# Altium schematic sheet TIDA01398_MCU.SchDoc: Wireless MCU
size 431 x 279 mm; Date: Not shown in title block; ApprovedBy: Not shown in title block; CheckedBy: Not shown in title block; Author: Not shown in title block; CompanyName: Not shown in title block; DrawnBy: Gustavo Martinez; Engineer: Not shown in title block; Organization: Not shown in title block; Address1: Not shown in title block; Address2: Not shown in title block; Address3: Not shown in title block; Address4: Not shown in title block; DocumentNumber: 1; Revision: Use project parameter SCH_Rev; SheetNumber: 3; SheetTotal: 4; PageSetup: Record=PageOptions|CenterHorizontal=True|CenterVertical=True|PrintScale=1.00|XCorrection=1.00|YCorrection=1.00|PrintKind=0|BorderSize=5000000|LeftOffset=0|BottomOffset=0|Orientation=2|PaperLength=1000|PaperWidth=1000|Scale=100|PaperSource=15|PrintQuality=600|MediaType=1|DitherType=10|PaperKind=Letter|PrintScaleMode=1; CurrentTime: Not shown in title block; CurrentDate: Not shown in title block; Time: Not shown in title block; DocumentFullPathAndName: Not shown in title block; DocumentName: Not shown in title block; ModifiedDate: Not shown in title block; ImagePath: Not shown in title block
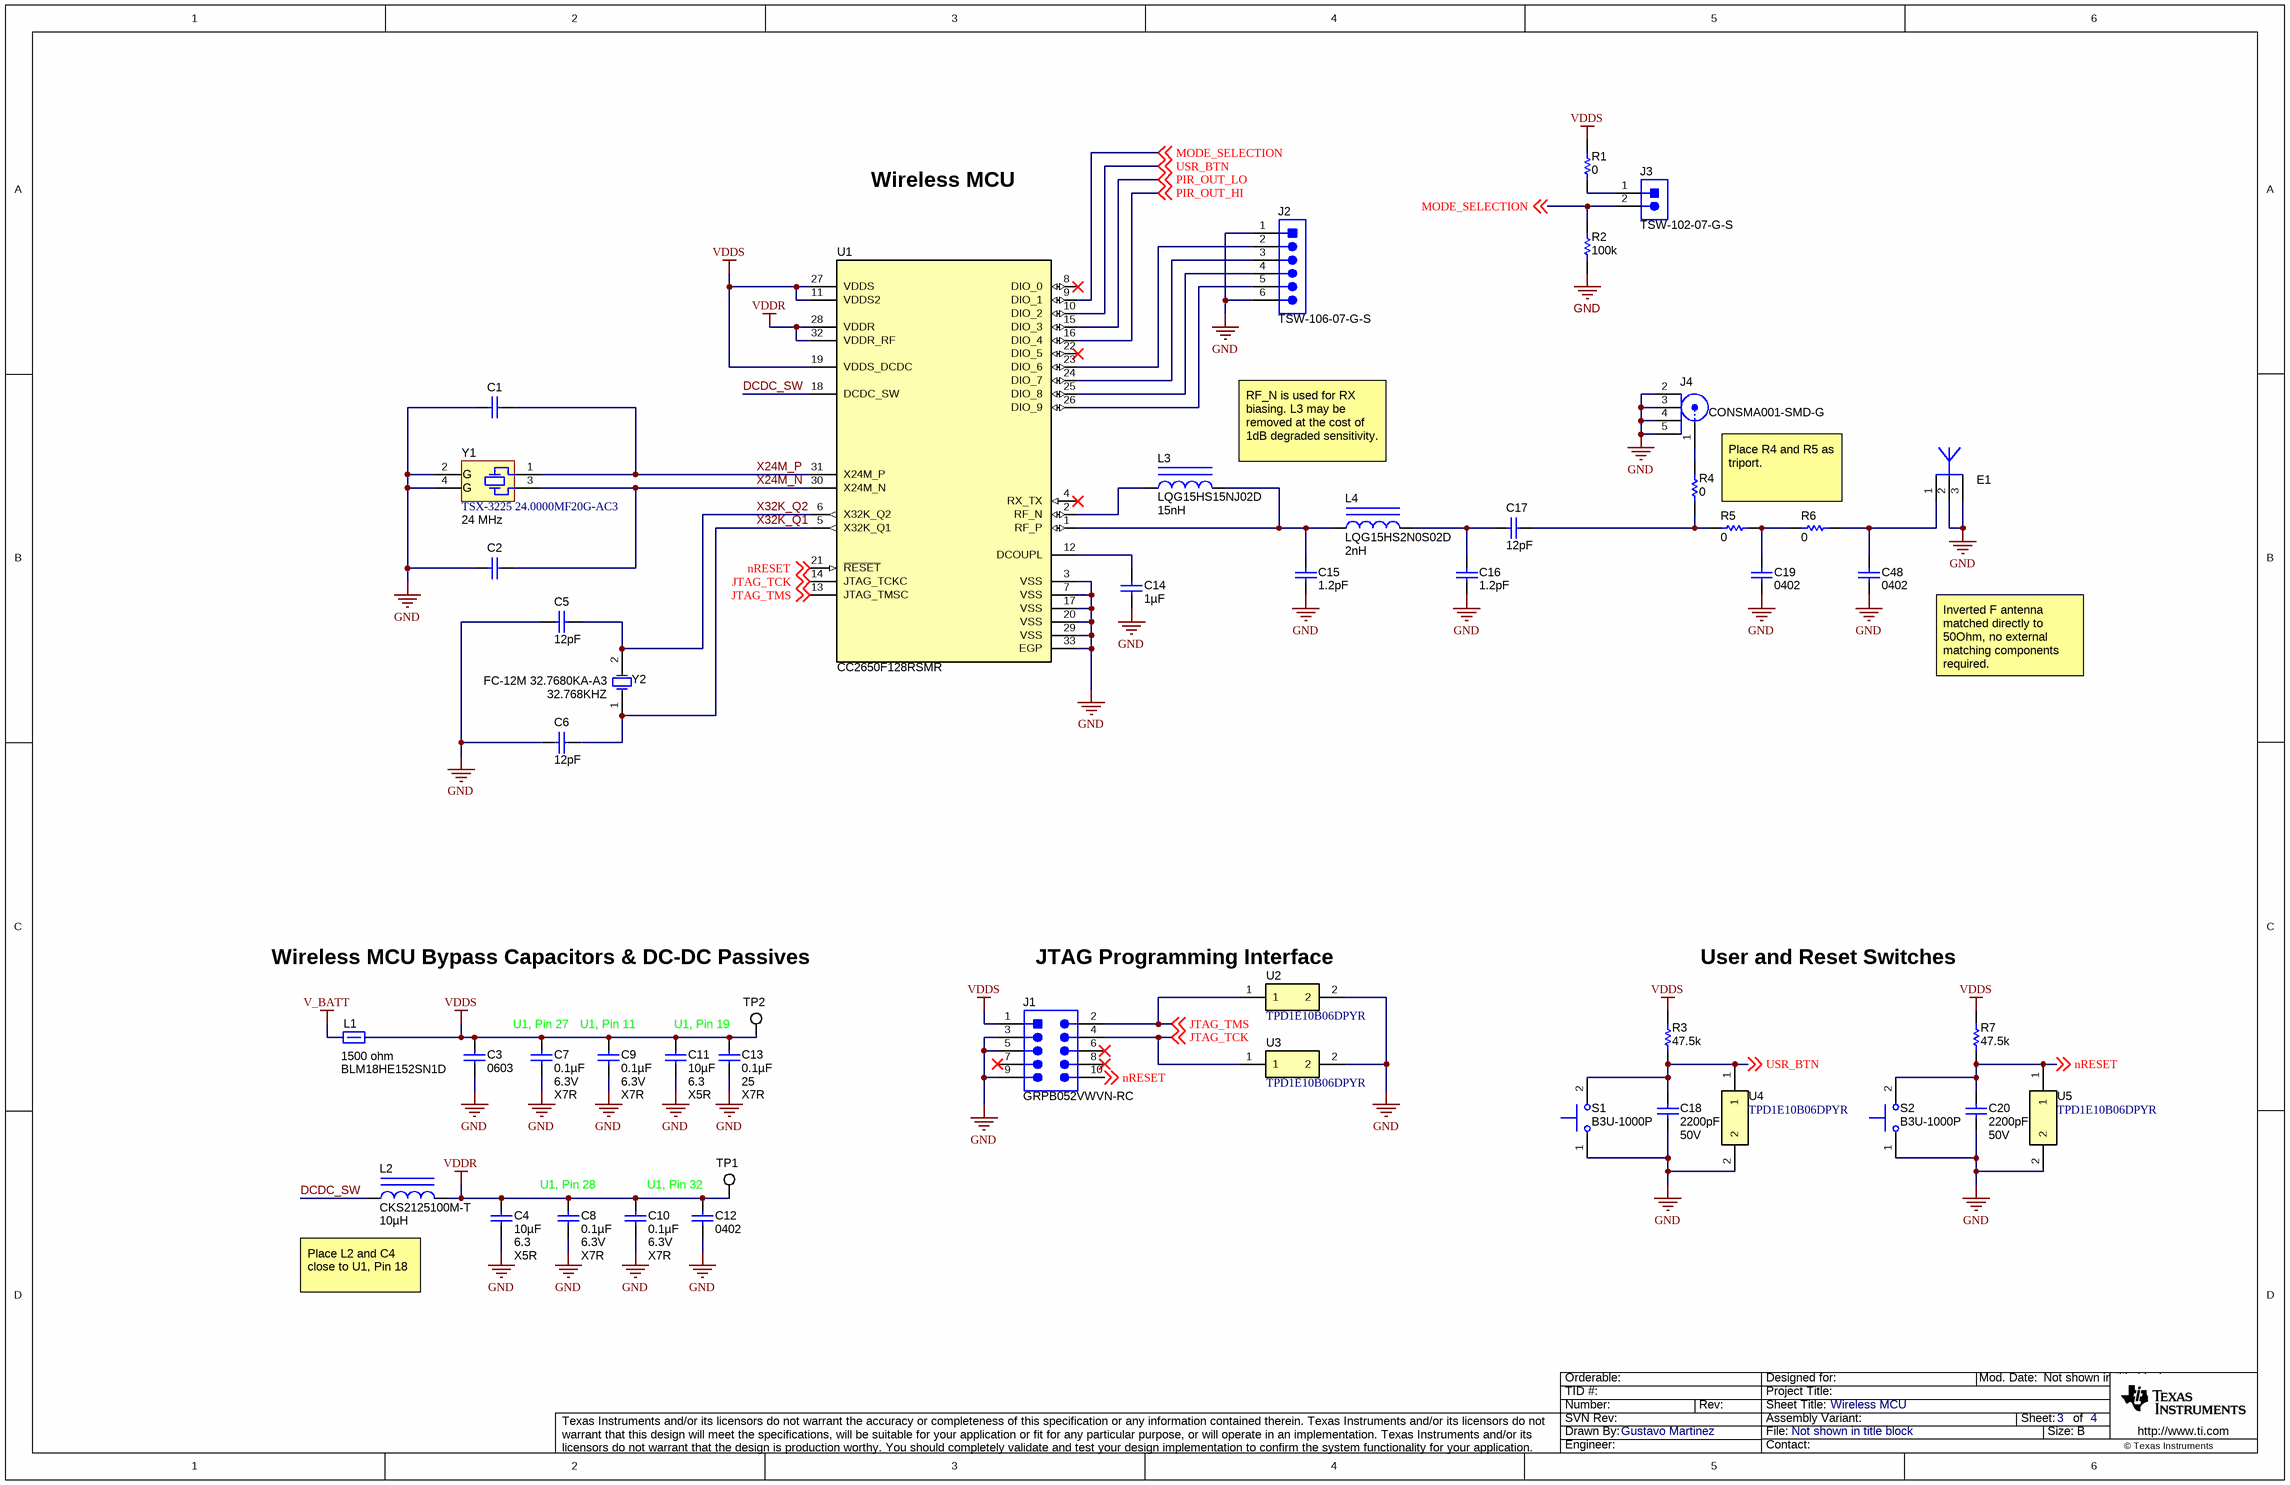
[diagram p0: TIDA01398_MCU.SchDoc]

## Parts
C1  GRM1555C1E120JA01D  [0402]  (value not drawn)
C2  GRM1555C1E120JA01D  [0402]  (value not drawn)
C3  Used in BOM report  [0603]  (value not drawn)
C4  ValueDisplayed: 10µF  VDC_V: 6.3  TempCo: X5R  [0603]  (hidden comment: GRM188R60J106ME47D)
C5  ValueDisplayed: 12pF  [0402]  (hidden comment: GRM1555C1E120JA01D)
C6  ValueDisplayed: 12pF  [0402]  (hidden comment: GRM1555C1E120JA01D)
C7  ValueDisplayed: 0.1µF  Value2: 6.3V  TempCo: X7R  [0402S]  (hidden comment: GRM155R70J104KA01D)
C8  ValueDisplayed: 0.1µF  Value2: 6.3V  TempCo: X7R  [0402S]  (hidden comment: GRM155R70J104KA01D)
C9  ValueDisplayed: 0.1µF  Value2: 6.3V  TempCo: X7R  [0402]  (hidden comment: GRM155R70J104KA01D)
C10  ValueDisplayed: 0.1µF  Value2: 6.3V  TempCo: X7R  [0402S]  (hidden comment: GRM155R70J104KA01D)
C11  ValueDisplayed: 10µF  VDC_V: 6.3  TempCo: X5R  [0603]  (hidden comment: GRM188R60J106ME47D)
C12  PackageReference: 0402  [0402S]  (hidden comment: Used in BOM report)
C13  ValueDisplayed: 0.1µF  VDC_V: 25  TempCo: X7R  [0603]  (hidden comment: GRM188R71E104KA01D)
C14  ValueDisplayed: 1µF  [0402]  (hidden comment: GRM155R61A105KE15D)
C15  ValueDisplayed: 1.2pF  [0402S]  (hidden comment: GRM1555C1H1R2BA01D)
C16  ValueDisplayed: 1.2pF  [0402S]  (hidden comment: GRM1555C1H1R2BA01D)
C17  ValueDisplayed: 12pF  [0402S]  (hidden comment: GRM1555C1H120JA01D)
C18  ValueDisplayed: 2200pF  Value2: 50V  [0402]  (hidden comment: C1005X7R1H222K)
C19  PackageReference: 0402  [0402S]  (hidden comment: Used in BOM report)
C20  ValueDisplayed: 2200pF  Value2: 50V  [0402]  (hidden comment: C1005X7R1H222K)
C48  PackageReference: 0402  [0402S]  (hidden comment: Used in BOM report)
E1  ANTENNA_DN007A  [ANTENNA_DN007A]  (value not drawn)  (net tie)
J1  GRPB052VWVN-RC  [CONN_GRPB052VWVN-RC]
J2  TSW-106-07-G-S  [TSW-106-07-G-S]
J3  TSW-102-07-G-S  [TSW-102-07-G-S]
J4  CONSMA001-SMD-G  [Linx_CONSMA001-SMD-G]
L1  value 1500 ohm  [0603]  (hidden comment: BLM18HE152SN1D)
L2  CKS2125100M-T  ValueDisplayed: 10µH  [0805_145]
L3  LQG15HS15NJ02D  ValueDisplayed: 15nH  [IND_LQG15H]
L4  LQG15HS2N0S02D  ValueDisplayed: 2nH  [IND_LQG15H]
R1  ValueDisplayed: 0  [0402]  (hidden comment: CRCW04020000Z0ED)
R2  ValueDisplayed: 100k  [0402]  (hidden comment: CRCW0402100KFKED)
R3  ValueDisplayed: 47.5k  [0402]  (hidden comment: CRCW040247K5FKED)
R4  ValueDisplayed: 0  [0402S]  (hidden comment: CRCW04020000Z0ED)
R5  ValueDisplayed: 0  [0402S]  (hidden comment: CRCW04020000Z0ED)
R6  ValueDisplayed: 0  [0402S]  (hidden comment: CRCW04020000Z0ED)
R7  ValueDisplayed: 47.5k  [0402]  (hidden comment: CRCW040247K5FKED)
S1  B3U-1000P  [SW_B3U-1000P]
S2  B3U-1000P  [SW_B3U-1000P]
TP1  5015  [Testpoint_Keystone_Miniature]  (value not drawn)
TP2  5015  [Testpoint_Keystone_Miniature]  (value not drawn)
U1  CC2650F128RSMR  [RSM0032B]
U2  TPD1E10B06DPYR  [DPY0002A]
U3  TPD1E10B06DPYR  [DPY0002A]
U4  TPD1E10B06DPYR  [DPY0002A]
U5  TPD1E10B06DPYR  [DPY0002A]
Y1  TSX-3225 24.0000MF20G-AC3  Frequency: 24 MHz  [EPSON_TSX-3225]
Y2  FC-12M 32.7680KA-A3  Frequency: 32.768KHZ  [Epson_FC-12M]

## Nets
GND: C1.1 C2.1 C3.2 C4.1 C5.2 C6.2 C7.2 C8.2 C9.2 C10.2 C11.1 C12.2 C13.1 C14.2 C15.2 C16.2 C18.1 C19.1 C20.1 C48.1 E1.2 E1.3 J1.3 J1.5 J1.9 J2.1 J2.6 J4.2 J4.3 J4.4 J4.5 R2.1 S1.1 S2.1 U1.3(VSS) U1.7(VSS) U1.17(VSS) U1.20(VSS) U1.29(VSS) U1.33(EGP) U2.2 U3.2 U4.2 U5.2 Y1.2(GND) Y1.4(GND)
V_BATT: L1.1
VDDR: C4.2 C8.1 C10.1 C12.1 L2.2 TP1.1 U1.28(VDDR) U1.32(VDDR_RF)
VDDS: C3.1 C7.1 C9.1 C11.2 C13.2 J1.1 L1.2 R1.2 R3.2 R7.2 TP2.1 U1.11(VDDS2) U1.19(VDDS_DCDC) U1.27(VDDS)
DCDC_SW: L2.1 U1.18(DCDC_SW)
JTAG_TCK: J1.4 U1.14(JTAG_TCKC) U3.1 ; off-sheet JTAG_TCK
JTAG_TMS: J1.2 U1.13(JTAG_TMSC) U2.1 ; off-sheet JTAG_TMS
MODE_SELECTION: J3.2 R2.2 U1.9(DIO_1) ; off-sheet MODE_SELECTION
nRESET: C20.2 J1.10 R7.1 S2.2 U1.21(~{RESET}) U5.1 ; off-sheet nRESET
PIR_OUT_HI: U1.16(DIO_4) ; off-sheet PIR_OUT_HI
PIR_OUT_LO: U1.15(DIO_3) ; off-sheet PIR_OUT_LO
USR_BTN: C18.2 R3.1 S1.2 U1.10(DIO_2) U4.1 ; off-sheet USR_BTN
X24M_N: C2.2 U1.30(X24M_N) Y1.3
X24M_P: C1.2 U1.31(X24M_P) Y1.1
X32K_Q1: C6.1 U1.5(X32K_Q1) Y2.1(OSC1)
X32K_Q2: C5.1 U1.6(X32K_Q2) Y2.2(OSC2)
NetC14_1: C14.1 U1.12(DCOUPL)
NetC15_1: C15.1 L3.2 L4.1 U1.1(RF_P)
NetC16_1: C16.1 C17.2 L4.2
NetC17_1: C17.1 R4.1 R5.1
NetC19_2: C19.2 R5.2 R6.1
NetC48_2: C48.2 E1.1 R6.2
NetJ2_2: J2.2 U1.23(DIO_6)
NetJ2_3: J2.3 U1.24(DIO_7)
NetJ2_4: J2.4 U1.25(DIO_8)
NetJ2_5: J2.5 U1.26(DIO_9)
NetJ3_1: J3.1 R1.1
NetJ4_1: J4.1 R4.2
NetL3_1: L3.1 U1.2(RF_N)

Not connected (* = marked no-connect by the designer): J1 6* 7* 8*; U1 4(RX_TX)* 8(DIO_0)* 22(DIO_5)*

## Notes on the sheet
- Wireless MCU
- (near L3) RF_N is used for RX biasing. L3 may be removed at the cost of 1dB degraded sensitivity.
- Place R4 and R5 as triport.
- Inverted F antenna matched directly to 50Ohm, no external matching components required.
- Wireless MCU Bypass Capacitors & DC-DC Passives
- (near U2) JTAG Programming Interface
- User and Reset Switches
- (near C7) U1, Pin 27
- (near C9) U1, Pin 11
- U1, Pin 19
- (near C8) U1, Pin 28
- U1, Pin 32
- (near L2) Place L2 and C4 close to U1, Pin 18
- Drawn By:
- SVN Rev:
- Number:
- TID #:
- Orderable:
- Rev:
- Sheet Title:
- File:
- Project Title:
- Designed for:
- Assembly Variant:
- Mod. Date:
- Sheet:
- Size:
- of
- B
- http://www.ti.com
- Texas Instruments and/or its licensors do not warrant the accuracy or completeness of this specification or any information contained therein. Texas Instruments and/or its licensors do not warrant that this design will meet the specifications, will be suitable for your application or fit for any particular purpose, or will operate in an implementation. Texas Instruments and/or its licensors do not warrant that the design is production worthy. You should completely validate and test your design implementation to confirm the system functionality for your application.
- Engineer:
- Contact:
- © Texas Instruments
- (in symbol TSX-3225 24.0000MF20G-AC3) G

## Library data of the parts
C1 C2 C5 C6 = GRM1555C1E120JA01D: CAP, CERM, 12 pF, 25 V, +/- 5%, C0G/NP0, 0402; Manufacturer: MuRata; Polarized: N; CompType: Capacitor; Value: 12pF; U/M: EA; Cap_F: 0.000000000012; Tolerance_%: 5; Value1: Unknown; VDC_V: 25; Value2: 25V; TaMin_C: -55; TaMax_C: 125; AEC Category: Q200; SymbolVersion: 2008-07-09; PartNumber: GRM1555C1E120JA01D; PackageReference: 0402; RoHS: Y; MountType: SMT; Publisher: Texas Instruments; LatestRevisionDate: 2015-08-30; ComponentLink1Description: Datasheet link; ComponentLink1URL: http://search.murata.co.jp/Ceramy/PnsearchViewAction.do?HnOFG=ON&HnNFG=ON&SEL_CNT=50&sLang=en&sKey=GRM1555C1E120JA01D&x=9&y=9&search=startwith; Technology: Ceramic; TempCo: C0G/NP0; Cap_Case: 0402; Published: 2008-06-19; Supplier 1: Mouser; Supplier Part Number 1: 81-GRM1555C1E120JA1D; AEC Qualified: ?
  C1 C2: ValueDisplayed: 12pF
C3 C12 C19 C48 = Capacitor: CAP, CERM, xxxF, xxV, [TempCo], xx%, [PackageReference]; Polarized: N; U/M: EA; CompType: Capacitor; SymbolVersion: 2008-07-09; Value: *; PartNumber: Used in BOM report; Manufacturer: Used in BOM report; RoHS: Used in BOM report.  Use Y or N.; MountType: SMT or TH (used in PnP report); Publisher: Texas Instruments; ComponentLink1Description: Datasheet Link; ComponentLink1URL: Paste URL for datasheet here; Alternate PartNumber: -; Alternate Manufacturer: -; LatestRevisionNote: Added Alternate PartNumber and Alternate Manufacturer parameters to appropriate components.
  C3: PackageReference: 0603; LatestRevisionDate: 2014-10-27
  C12: LatestRevisionDate: 2014-10-27
  C19 C48: LatestRevisionDate: 2014-08-01
C4 C11 = GRM188R60J106ME47D: CAP, CERM, 10 µF, 6.3 V, +/- 20%, X5R, 0603; Manufacturer: MuRata; Polarized: N; CompType: Capacitor; Value: 10uF; U/M: EA; Cap_F: 0.00001; Tolerance_%: 20; ESR_ohm: 0.009; Value1: 0.009 ohm; Value2: 6.3V; IRMS_A: 2.74; TaMin_C: -55; TaMax_C: 125; AEC Category: Q200; SymbolVersion: 2008-07-09; PartNumber: GRM188R60J106ME47D; PackageReference: 0603; RoHS: Y; MountType: SMT; Technology: Ceramic; Cap_Case: 0603; Published: 2008-06-19; Publisher: Texas Instruments; LatestRevisionDate: 2016-02-01; ComponentLink1Description: Datasheet link; ComponentLink1URL: http://www.murata.com/products/capacitor/tech_data/pdf/grm188r60j106m.pdf; Supplier 1: Digi-Key; Supplier Part Number 1: 490-3896-1-ND; Supplier 2: Mouser; Supplier Part Number 2: 81-GRM188R60J106ME47; Supplier 3: Farnell; Supplier Part Number 3: 1735528; AEC Qualified: ?
C7 C8 C10 = GRM155R70J104KA01D: CAP, CERM, 0.1 µF, 6.3 V, +/- 10%, X7R, 0402; Manufacturer: MuRata; Polarized: N; CompType: Capacitor; Value: 0.1uF; U/M: EA; Cap_F: 0.0000001; Tolerance_%: 10; Value1: Unknown; VDC_V: 6.3; TaMin_C: -55; TaMax_C: 125; Cap_Case: 0402; SymbolVersion: 2008-07-09; PartNumber: GRM155R70J104KA01D; PackageReference: 0402; RoHS: Y; MountType: SMT; Technology: Ceramic; Published: 2008-06-19; Publisher: Texas Instruments; LatestRevisionDate: 2014-08-08; ComponentLink1Description: Datasheet link; ComponentLink1URL: http://search.murata.co.jp/Ceramy/PnsearchViewAction.do?HnOFG=ON&HnNFG=ON&SEL_CNT=50&sLang=en&sKey=GRM155R70J104KA01D&x=9&y=9&search=startwith; Supplier 1: Digi-Key; Supplier Part Number 1: GRM155R70J104KA01D-ND; Supplier 2: Mouser; Supplier Part Number 2: 81-GRM155R70J104KA1D
C9 = GRM155R70J104KA01D: CAP, CERM, 0.1 µF, 6.3 V, +/- 10%, X7R, 0402; Manufacturer: MuRata; Polarized: N; CompType: Capacitor; Value: 0.1uF; U/M: EA; Cap_F: 0.0000001; Tolerance_%: 10; Value1: Unknown; VDC_V: 6.3; TaMin_C: -55; TaMax_C: 125; SymbolVersion: 2008-07-09; PartNumber: GRM155R70J104KA01D; PackageReference: 0402; RoHS: Y; MountType: SMT; Technology: Ceramic; Cap_Case: 0402; Published: 2008-06-19; Publisher: Texas Instruments; LatestRevisionDate: 2014-08-08; ComponentLink1Description: Datasheet link; ComponentLink1URL: http://search.murata.co.jp/Ceramy/PnsearchViewAction.do?HnOFG=ON&HnNFG=ON&SEL_CNT=50&sLang=en&sKey=GRM155R70J104KA01D&x=9&y=9&search=startwith; Supplier 1: Digi-Key; Supplier Part Number 1: GRM155R70J104KA01D-ND; Supplier 2: Mouser; Supplier Part Number 2: 81-GRM155R70J104KA1D
C13 = GRM188R71E104KA01D: CAP, CERM, 0.1 µF, 25 V, +/- 10%, X7R, 0603; Manufacturer: MuRata; Polarized: N; CompType: Capacitor; Value: 0.1uF; U/M: EA; Cap_F: 0.0000001; Tolerance_%: 10; Value1: Unknown; Value2: 25V; TaMin_C: -55; TaMax_C: 125; AEC Category: Q200; SymbolVersion: 2008-07-09; PartNumber: GRM188R71E104KA01D; PackageReference: 0603; RoHS: Y; MountType: SMT; Technology: Ceramic; Cap_Case: 0603; Published: 2008-06-19; Publisher: Texas Instruments; LatestRevisionDate: 2016-02-01; ComponentLink1Description: Datasheet link; ComponentLink1URL: http://search.murata.co.jp/Ceramy/PnsearchViewAction.do?HnOFG=ON&HnNFG=ON&SEL_CNT=50&sLang=en&sKey=GRM188R71E104KA01D&x=9&y=9&search=startwith; Supplier 1: Digi-Key; Supplier Part Number 1: 490-1524-1-ND; Supplier 2: Mouser; Supplier Part Number 2: 81-GRM39X104K25; Supplier 3: Farnell; Supplier Part Number 3: 1828899; AEC Qualified: ?
C14 = GRM155R61A105KE15D: CAP, CERM, 1 µF, 10 V, +/- 10%, X5R, 0402; Manufacturer: MuRata; Polarized: N; CompType: Capacitor; Value: 1uF; U/M: EA; Cap_F: 0.000001; Tolerance_%: 10; Value1: Unknown; Value2: 10V; TaMin_C: -55; TaMax_C: 85; AEC Category: Q200; SymbolVersion: 2008-07-09; PartNumber: GRM155R61A105KE15D; PackageReference: 0402; RoHS: Y; VDC_V: 10; MountType: SMT; Technology: Ceramic; TempCo: X5R; Cap_Case: 0402; Published: 2008-06-19; Publisher: Texas Instruments; LatestRevisionDate: 2016-02-01; ComponentLink1Description: Datasheet link; ComponentLink1URL: http://search.murata.co.jp/Ceramy/PnsearchViewAction.do?HnOFG=ON&HnNFG=ON&SEL_CNT=50&sLang=en&sKey=GRM155R61A105KE15D&x=9&y=9&search=startwith; Supplier 1: Digi-Key; Supplier Part Number 1: 490-3890-1-ND; Supplier 2: Mouser; Supplier Part Number 2: 81-GRM155R61A105KE15; Supplier 3: Farnell; Supplier Part Number 3: 1735523; AEC Qualified: ?
C15 C16 = GRM1555C1H1R2BA01D: CAP, CERM, 1.2 pF, 50 V, +/- 8.3%, C0G/NP0, 0402; Manufacturer: MuRata; Polarized: N; CompType: Capacitor; Value: 1.2pF; U/M: EA; Cap_F: 0.0000000000012; Tolerance_%: 8.3; Value1: Unknown; VDC_V: 50; Value2: 50V; TaMin_C: -55; TaMax_C: 125; Cap_Case: 0402; AEC Category: Q200; SymbolVersion: 2008-07-09; PartNumber: GRM1555C1H1R2BA01D; PackageReference: 0402; RoHS: Y; MountType: SMT; Technology: Ceramic; TempCo: C0G/NP0; Published: 2008-06-19; Publisher: Texas Instruments; LatestRevisionDate: 2015-12-09; ComponentLink1Description: Datasheet link; ComponentLink1URL: http://search.murata.co.jp/Ceramy/image/img/A01X/G101/ENG/GRM1555C1H1R2BA01-01.pdf; Supplier 1: Digi-Key; Supplier Part Number 1: 490-6209-1-ND; Supplier 2: Mouser; Supplier Part Number 2: 81-GRM1555C1H1R2BA1D; AEC Qualified: ?
C17 = GRM1555C1H120JA01D: CAP, CERM, 12 pF, 50 V, +/- 5%, C0G/NP0, 0402; Manufacturer: MuRata; Polarized: N; CompType: Capacitor; Value: 12pF; U/M: EA; Cap_F: 0.000000000012; Tolerance_%: 5; Value1: Unknown; VDC_V: 50; Value2: 50V; TaMin_C: -55; TaMax_C: 125; Cap_Case: 0402; AEC Category: Q200; SymbolVersion: 2008-07-09; PartNumber: GRM1555C1H120JA01D; PackageReference: 0402; RoHS: Y; MountType: SMT; Technology: Ceramic; TempCo: C0G/NP0; Published: 2008-06-19; Publisher: Texas Instruments; LatestRevisionDate: 2015-12-09; ComponentLink1Description: Datasheet link; ComponentLink1URL: http://search.murata.co.jp/Ceramy/PnsearchViewAction.do?HnOFG=ON&HnNFG=ON&SEL_CNT=50&sLang=en&sKey=GRM1555C1H120JA01D&x=9&y=9&search=startwith; Supplier 1: Mouser; Supplier Part Number 1: 81-GRM1555C1H120JA1D; Supplier 2: Farnell; Supplier Part Number 2: 1828875; Supplier 3: Newark; Supplier Part Number 3: 14T3292; AEC Qualified: ?
C18 C20 = C1005X7R1H222K: CAP, CERM, 2200 pF, 50 V, +/- 10%, X7R, 0402; Manufacturer: TDK; Polarized: N; CompType: Capacitor; Value: 2200pF; U/M: EA; Cap_F: 0.0000000022; Tolerance_%: 10; ESR_ohm: 0.1433; Value1: 0.1433 ohm; VDC_V: 50; TaMin_C: -55; TaMax_C: 125; AEC Category: Q200; SymbolVersion: 2008-07-09; PartNumber: C1005X7R1H222K; PackageReference: 0402; RoHS: Y; MountType: SMT; Technology: Ceramic; TempCo: X7R; Cap_Case: 0402; Published: 2008-06-19; Publisher: Texas Instruments; LatestRevisionDate: 2015-08-30; ComponentLink1Description: Datasheet link; ComponentLink1URL: http://www.tdk.co.jp/tefe02/e412_c.pdf; Supplier 1: Digi-Key; Supplier Part Number 1: 445-1257-1-ND; Supplier 2: Farnell; Supplier Part Number 2: 1907279; AEC Qualified: ?
E1 = ANTENNA_DN007A: 2.4GHz PCB Antenna.  There is nothing to buy or mount.; SymbolCreator: a0412235; SymbolVersion: 2014-08-14; PartNumber: ANTENNA_DN007A; Manufacturer: N/A; CompType: Antenna; MountType: N/A; ComponentLink1Description: Datasheet Link; ComponentLink1URL: https://sps06.itg.ti.com/sites/KMS/crossdivteams/altium/docs/ComponentDatasheets/CC26xxEM-7IB_1_0_Layout.pdf; PackageReference: SMD, 3-Leads; Publisher: Texas Instruments; LatestRevisionDate: 2015-12-09
J1 = GRPB052VWVN-RC: Header, 50mil, 5x2, Gold, TH; Manufacturer: Sullins Connector Solutions; SymbolCreator: a0412235; U/M: EA; SymbolVersion: 2013-12-22; PartNumber: GRPB052VWVN-RC; PackageReference: Header, 5x2, 50mil; CompType: Header; RoHS: Y; MountType: TH; ComponentLink1Description: Datasheet Link; ComponentLink1URL: http://www.sullinscorp.com/catalogs/71_Page70-71_HEADER_.050_1.27mm_MALE.pdf; Publisher: Texas Instruments; LatestRevisionDate: 2015-08-06; Supplier 1: Digi-Key; Supplier Part Number 1: S9015E-05-ND; ClassName: Header
J2 = TSW-106-07-G-S: Header, 100mil, 6x1, Gold, TH; Manufacturer: Samtec; SymbolCreator: a0412235; U/M: EA; SymbolVersion: 2013-08-30; PartNumber: TSW-106-07-G-S; PackageReference: 6x1 Header; ClassName: Header; CompType: Header; RoHS: Y; MountType: TH; ComponentLink1Description: Datasheet Link; ComponentLink1URL: http://samtec.com/ftppub/pdf/TSW_TH.PDF; Publisher: Texas Instruments; LatestRevisionDate: 2015-08-25; Supplier 1: Digi-Key; Supplier Part Number 1: SAM1029-06-ND
J3 = TSW-102-07-G-S: Header, 100mil, 2x1, Gold, TH; Manufacturer: Samtec; SymbolCreator: a0412235; U/M: EA; SymbolVersion: 2013-10-31; PartNumber: TSW-102-07-G-S; PackageReference: 2x1 Header; ClassName: Header; CompType: Header; RoHS: Y; MountType: TH; ComponentLink1Description: Datasheet Link; ComponentLink1URL: http://samtec.com/ftppub/pdf/TSW_TH.PDF; Publisher: Texas Instruments; LatestRevisionDate: 2015-08-25; Supplier 1: Digi-Key; Supplier Part Number 1: SAM1029-02-ND
J4 = CONSMA001-SMD-G: Jack, SMA, PCB, Gold, SMT; Manufacturer: Linx Technologies; SymbolCreator: X0208326; U/M: EA; SymbolVersion: 2012-12-24; PartNumber: CONSMA001-SMD-G; PackageReference: SMA Jack; CompType: JACK; RoHS: Y; MountType: SMT; ComponentLink1Description: Datasheet Link; ComponentLink1URL: https://www.linxtechnologies.com/resources/diagrams/consma001-smd-g.pdf; Publisher: Texas Instruments; LatestRevisionDate: 2015-08-25; Supplier 1: Digi-Key; Supplier Part Number 1: CONSMA001-SMD-G-ND; Supplier 2: Mouser; Supplier Part Number 2: 712-CONSMA001-SMD-G
L1 = BLM18HE152SN1D: Ferrite Bead, 1500 ohm @ 100 MHz, 0.5 A, 0603; Manufacturer: MuRata; Imax_A: 0.5; Value1: 0.5 ohm; Value2: 0.5A; ZTyp@100MHz_Ohm: 1500; CompType: Ferrite Bead; SymbolVersion: 2009-06-02; PartNumber: BLM18HE152SN1D; DCR_ohm: 0.5; MountType: SMT; PackageReference: 0603; Published: 2014-04-30; Publisher: Texas Instruments; LatestRevisionDate: 2016-01-14; ComponentLink1Description: Datasheet link; ComponentLink1URL: http://search.murata.co.jp/Ceramy/image/img/PDF/ENG/L0110S0101BLM18H.pdf; RoHS: Y; Ztyp@1GHz_Ohm: 1500; Supplier 1: Digi-Key; Supplier Part Number 1: 490-5216-1-ND; Supplier 2: Mouser; Supplier Part Number 2: 81-BLM18HE152SN1D; Supplier 3: Farnell; Supplier Part Number 3: 2443237RL
L2 = CKS2125100M-T: Inductor, Multilayer, Ferrite, 10uH, 0.11A, 0.52 ohm, SMD; Manufacturer: Taiyo Yuden; Ind_H: 10.0E-6; Imax_A: 0.11; DCR_ohm: 0.52; SymbolVersion: 2008-07-23; CompType: Inductor; Value: 10uH; PartNumber: CKS2125100M-T; Value1: 0.52 ohm; Value2: 0.11A; Technology: Multilayer; MountType: SMT; Material: Ferrite; PackageReference: 0805; Published: 2008-06-26; Publisher: Texas Instruments; LatestRevisionDate: 2014-08-13; ComponentLink1Description: Datasheet link; ComponentLink1URL: http://www.yuden.co.jp/ut/product/category/inductor/CKS2125100M-T.pdf; RoHS: Y; Supplier 1: Digi-Key; Supplier Part Number 1: 587-2608-1-ND; Supplier 2: Mouser; Supplier Part Number 2: 963-CKS2125100M-T; Supplier 3: Farnell; Supplier Part Number 3: 2084785
L3 = LQG15HS15NJ02D: Inductor, Multilayer, Air Core, 15 nH, 0.3 A, 0.32 ohm, SMD; Manufacturer: MuRata; Value: 15nH; Ind_H: 15.0E-9; Imax_A: 0.3; Irms: 0.3A @ C rise; Isat: 0.3A @ % inductance drop; DCR_ohm: 0.32; Value2: 0.3A; AEC Category: Q200; SymbolVersion: 2008-07-23; CompType: Inductor; PartNumber: LQG15HS15NJ02D; Value1: 0.32 ohm; Technology: Multilayer; MountType: SMT; Material: Air Core; PackageReference: 0402 polarized; Published: 2008-06-26; Publisher: Texas Instruments; LatestRevisionDate: 2015-12-14; ComponentLink1Description: Datasheet link; ComponentLink1URL: http://search.murata.co.jp/Ceramy/image/img/PDF/ENG/L0075S0083LQG15HS.pdf; RoHS: Y; Supplier 1: Digi-Key; Supplier Part Number 1: 490-2625-1-ND; Supplier 2: Mouser; Supplier Part Number 2: 81-LQG15HS15NJ02D; AEC Qualified: ?
L4 = LQG15HS2N0S02D: Inductor, Multilayer, Air Core, 2 nH, 0.3 A, 0.1 ohm, SMD; Manufacturer: MuRata; Value: 2nH; Ind_H: 2.0E-9; Imax_A: 0.3; Irms: 0.3A @ C rise; Isat: 0.3A @ % inductance drop; DCR_ohm: 0.1; Value1: 0.1 ohm; Value2: 0.3A; AEC Category: Q200; SymbolVersion: 2008-07-23; CompType: Inductor; PartNumber: LQG15HS2N0S02D; Technology: Multilayer; MountType: SMT; Material: Air Core; PackageReference: 0402 polarized; Published: 2008-06-26; Publisher: Texas Instruments; LatestRevisionDate: 2015-12-14; ComponentLink1Description: Datasheet link; ComponentLink1URL: http://search.murata.co.jp/Ceramy/image/img/PDF/ENG/L0075S0083LQG15HS.pdf; RoHS: Y; Supplier 1: Digi-Key; Supplier Part Number 1: 490-6569-1-ND; Supplier 2: Mouser; Supplier Part Number 2: 81-LQG15HS2N0S02D; AEC Qualified: ?
R1 R4-R6 = CRCW04020000Z0ED: RES, 0, 5%, 0.063 W, 0402; Manufacturer: Vishay-Dale; CompType: Resistor; Value: 0; Value_Code: 0000; Tolerance_%: 5; Power_W: 0.063; Value2: 0.063W; VDC_V: 50; TempCo: 200 ppm/C; EIA_Code: E24; U/M: EA; AEC Category: Q200; SymbolVersion: 2009-05-29; PartNumber: CRCW04020000Z0ED; PackageReference: 0402; RoHS: Y; Res_ohm: 0; Value1: 5%; MountType: SMT; Technology: Thick Film; Published: 2008-06-26; Publisher: Texas Instruments; ComponentLink1Description: Datasheet link; ComponentLink1URL: http://www.vishay.com/docs/20035/dcrcwe3.pdf; Supplier 1: Digi-Key; Supplier Part Number 1: 541-0.0JCT-ND; Supplier 2: Mouser; Supplier Part Number 2: 71-CRCW0402-0-E3; Supplier 3: Farnell; Supplier Part Number 3: 1469661; AEC Qualified: ?
  R1: LatestRevisionDate: 2015-08-22
  R4-R6: LatestRevisionDate: 2015-10-23
R2 = CRCW0402100KFKED: RES, 100 k, 1%, 0.063 W, 0402; Manufacturer: Vishay-Dale; CompType: Resistor; Value: 100k; Res_ohm: 100000; Tolerance_%: 1; Power_W: 0.063; Value2: 0.063W; VDC_V: 50; TempCo: 100 ppm/C; EIA_Code: E96; U/M: EA; AEC Category: Q200; SymbolVersion: 2009-05-29; PartNumber: CRCW0402100KFKED; PackageReference: 0402; RoHS: Y; Value_Code: 100k; Value1: 1%; MountType: SMT; Technology: Thick Film; Published: 2008-06-26; Publisher: Texas Instruments; LatestRevisionDate: 2015-08-22; ComponentLink1Description: Datasheet link; ComponentLink1URL: http://www.vishay.com/docs/20035/dcrcwe3.pdf; Supplier 1: Digi-Key; Supplier Part Number 1: 541-100KLCT-ND; Supplier 2: Mouser; Supplier Part Number 2: 71-CRCW0402-100K-E3; Supplier 3: Farnell; Supplier Part Number 3: 1469671; AEC Qualified: ?
R3 R7 = CRCW040247K5FKED: RES, 47.5 k, 1%, 0.063 W, 0402; Manufacturer: Vishay-Dale; CompType: Resistor; Res_ohm: 47500; Value: 47.5k; Value_Code: 47k5; Tolerance_%: 1; Power_W: 0.063; Value2: 0.063W; VDC_V: 50; TempCo: 100 ppm/C; EIA_Code: E96; U/M: EA; AEC Category: Q200; SymbolVersion: 2009-05-29; PartNumber: CRCW040247K5FKED; PackageReference: 0402; RoHS: Y; Value1: 1%; MountType: SMT; Technology: Thick Film; Published: 2008-06-26; Publisher: Texas Instruments; LatestRevisionDate: 2015-08-22; ComponentLink1Description: Datasheet link; ComponentLink1URL: http://www.vishay.com/docs/20035/dcrcwe3.pdf; Supplier 1: Digi-Key; Supplier Part Number 1: 541-47.5KLCT-ND; Supplier 2: Mouser; Supplier Part Number 2: 71-CRCW0402-47.5K-E3; Supplier 3: Farnell; Supplier Part Number 3: 1652799; AEC Qualified: ?
S1 S2 = B3U-1000P: SWITCH TACTILE SPST-NO 0.05A 12V; Manufacturer: Omron Electronic Components; SymbolCreator: a0412235; VDC_V: 12; SwitchFunction: Off-Mom; PositionCount: 1; CurrentRating_mA: 50; SymbolVersion: 2012-10-29; PartNumber: B3U-1000P; MountType: SMT; ComponentLink1Description: Datasheet URL; ComponentLink1URL: http://www.components.omron.com/components/web/PDFLIB.nsf/0/2DD3893C7DD33E9E862572900079E9D6/$file/B3U_1110.pdf; RoHS: Y; Circuit: SPST-NO; Orientation: Top Actuated; CompType: Switch; PackageReference: 3x1.6x2.5mm; Publisher: Texas Instruments; LatestRevisionDate: 2015-08-27; Supplier 1: Digi-Key; Supplier Part Number 1: SW1020CT-ND; Supplier 2: Mouser; Supplier Part Number 2: 653-B3U-1000P; Supplier 3: Farnell; Supplier Part Number 3: 1333652
TP1 TP2 = 5015: Test Point, Miniature, SMT; Manufacturer: Keystone; CompType: Test Point Loop; U/M: EA; SymbolVersion: 2008-07-10; PartNumber: 5015; Value: SMT; PackageReference: Testpoint_Keystone_Miniature; RoHS: Y; MountType: SMT; ComponentLink1Description: Datasheet Link; ComponentLink1URL: http://www.keyelco.com/userAssets/store/files/5015.PDF; Publisher: Texas Instruments; LatestRevisionDate: 2014-11-22; Supplier 1: Digi-Key; Supplier Part Number 1: 5015KCT-ND
U1 = CC2650F128RSMR: Ultra low-power ARM Cortex M3 2.4 GHz Radio MCU, RSM0032B; Alternate PartNumber: CC2650F128RSMT; Manufacturer: Texas Instruments; SymbolCreator: Altium; CompType: IC; U/M: EA; SymbolVersion: 2015-03-05; PartNumber: CC2650F128RSMR; PackageReference: RSM0032B; MountType: SMT; ComponentLink1Description: Datasheet Link; ComponentLink1URL: http://www.ti.com/lit/ds/symlink/cc2650.pdf; RoHS: Y; Publisher: Texas Instruments; LatestRevisionDate: 2015-12-14; Alternate Manufacturer: Texas Instruments
U2-U5 = TPD1E10B06DPYR: ESD in 0402 Package with 10 pF Capacitance and 6 V Breakdown, 1 Channel, -40 to +125 degC, 2-pin X2SON (DPY), Green (RoHS & no Sb/Br); Manufacturer: Texas Instruments; Alternate PartNumber: Equivalent; Breakdown Voltage(Min)(V): 6; Eco-Plan: TBD; IEC 61000-4-2 Air-Gap(+/- kV): 30; IO Capacitance(Typ)(pF): 10; SubFamily: ESD Solution; DatasheetVersion: SLLSEB1; PackageVersion: revA, Apr-2010; PackageReference: DPY0002A; PackageDescription: 2-Pin Plastic Small Outline No-Lead 1.0 x 0.6 x 0.4 mm Body; Supplier 1: Digi-Key; Supplier Part Number 1: 296-30406-2-ND; Supplier 2: Digi-Key; Supplier Part Number 2: 296-30406-1-ND; Supplier 3: Digi-Key; Supplier Part Number 3: 296-30406-6-ND; Supplier 4: Newark; Supplier Part Number 4: 94T1842; Supplier 5: Mouser; Supplier Part Number 5: 595-TPD1E10B06DPYR; IEC 61000-4-2 Contact(+/- kV): 30; IO Leakage Current(nA): 10; MountType: SMT; PartNumber: TPD1E10B06DPYR; ComponentLink1Description: Datasheet; ComponentLink1URL: http://www.ti.com/general/docs/lit/getliterature.tsp?genericPartNumber=TPD1E10B06&fileType=pdf; ComponentLink2Description: URL Link1; ComponentLink2URL: SamplesURL:http://www.ti.com/product/tpd1e10b06#samples; Alternate Manufacturer: Texas Instruments
Y1 = TSX-3225 24.0000MF20G-AC3: Crystal, 24 MHz, 9 pF, SMD; Manufacturer: Epson; SymbolCreator: a0412235; U/M: EA; TaMin_C: -40; TaMax_C: 85; Frequency Stability: ±20ppm; SymbolVersion: 2011-08-23; PartNumber: TSX-3225 24.0000MF20G-AC3; CompType: Crystal; PackageReference: SMD, 4-Leads, Body 2.65x3.35mm, Height 0.6mm; MountType: SMT; RoHS: Y; ComponentLink1Description: Datasheet Link; ComponentLink1URL: http://www.eea.epson.com/portal/pls/portal/docs/1/1729491.PDF; Publisher: Texas Instruments; LatestRevisionDate: 2015-08-26; Supplier 1: Digi-Key; Supplier Part Number 1: SER3634CT-ND; Supplier 2: Mouser; Supplier Part Number 2: 732-TX325-24F20G-AC3
Y2 = FC-12M 32.7680KA-A3: Crystal, 32.768kHz, 12.5pF, SMD; Manufacturer: Epson; SymbolCreator: a0412235; U/M: EA; TaMin_C: -40; TaMax_C: 85; Frequency Stability: ±20ppm; SymbolVersion: 2008-07-09; PartNumber: FC-12M 32.7680KA-A3; CompType: Crystal; PackageReference: Crystal 2.05x.6x1.2mm; MountType: SMT; RoHS: Y; ComponentLink1Description: Datasheet Link; ComponentLink1URL: http://www.eea.epson.com/portal/pls/portal/docs/1/1587453.PDF; Publisher: Texas Instruments; LatestRevisionDate: 2015-08-26; Supplier 1: Digi-Key; Supplier Part Number 1: SER3672CT-ND; Supplier 2: Mouser; Supplier Part Number 2: 732-FC-12M-32.76KAA3